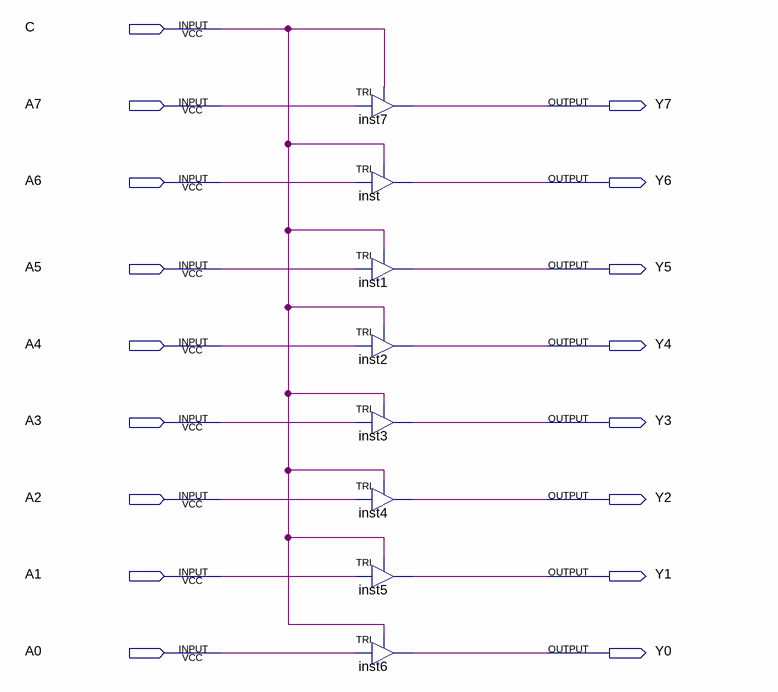
[diagram p0: schematic sheet]
// Quartus schematic Block5.bdf as structural Verilog: 8 symbols, 17 pins
module Block5 (
  input  C,
  input  A7,
  input  A6,
  input  A5,
  input  A4,
  input  A3,
  input  A2,
  input  A1,
  input  A0,
  output Y7,
  output Y6,
  output Y5,
  output Y4,
  output Y3,
  output Y2,
  output Y1,
  output Y0
);

  TRI inst7 (.IN(A7), .OE(C), .OUT(Y7));
  TRI inst (.IN(A6), .OE(C), .OUT(Y6));
  TRI inst1 (.IN(A5), .OE(C), .OUT(Y5));
  TRI inst2 (.IN(A4), .OE(C), .OUT(Y4));
  TRI inst3 (.IN(A3), .OE(C), .OUT(Y3));
  TRI inst4 (.IN(A2), .OE(C), .OUT(Y2));
  TRI inst5 (.IN(A1), .OE(C), .OUT(Y1));
  TRI inst6 (.IN(A0), .OE(C), .OUT(Y0));
endmodule
